# Altium schematic sheet LPC1769_2.SchDoc: LPC1769_2
size A4
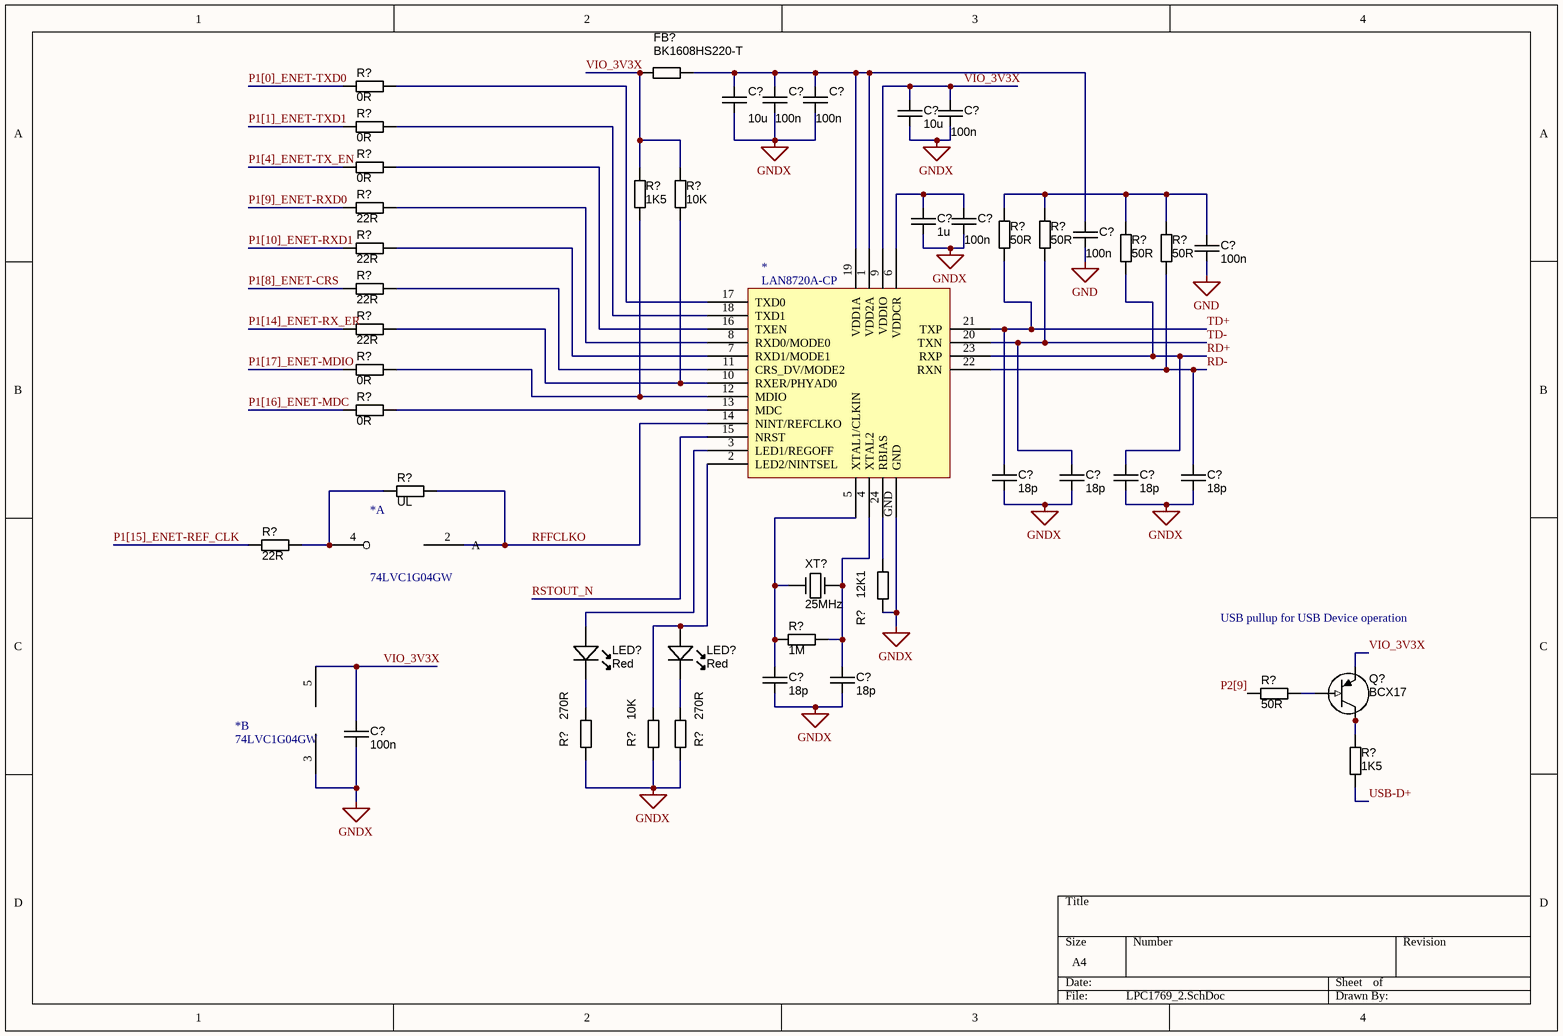
[diagram p0: LPC1769_2.SchDoc]

## Parts
(Parts that share a designator on the sheet are numbered #1, #2 ... from top to bottom, then left to right.)
*#1  LAN8720A-CP
*#2  74LVC1G04GW  (part A of 2)
*#3  74LVC1G04GW  (part B of 2)
C?#1  value 10u  [CAPC2012N]  (hidden comment: approved sub OK)
C?#2  value 100n  [CAPC2012N]  (hidden comment: approved sub OK)
C?#3  value 100n  [CAPC2012N]  (hidden comment: approved sub OK)
C?#4  value 10u  [CAPC2012N]  (hidden comment: approved sub OK)
C?#5  value 100n  [CAPC2012N]  (hidden comment: approved sub OK)
C?#6  value 1u  [CAPC2012N]  (hidden comment: approved sub OK)
C?#7  value 100n  [CAPC2012N]  (hidden comment: approved sub OK)
C?#8  value 100n  [CAPC2012N]  (hidden comment: approved sub OK)
C?#9  value 100n  [CAPC2012N]  (hidden comment: approved sub OK)
C?#10  value 18p  [CAPC2012N]  (hidden comment: approved sub OK)
C?#11  value 18p  [CAPC2012N]  (hidden comment: approved sub OK)
C?#12  value 18p  [CAPC2012N]  (hidden comment: approved sub OK)
C?#13  value 18p  [CAPC2012N]  (hidden comment: approved sub OK)
C?#14  value 18p  [CAPC2012N]  (hidden comment: approved sub OK)
C?#15  value 18p  [CAPC2012N]  (hidden comment: approved sub OK)
C?#16  value 100n  [CAPC2012N]  (hidden comment: approved sub OK)
FB?  value BK1608HS220-T  [RESC1005N]  (hidden comment: Thick Film)
LED?#1  Red  [LED-0805-A]
LED?#2  Red  [LED-0805-A]
Q?  Manufacturer Part Number 1: BCX17  [SOT223]  (hidden comment: PNP)
R?#1  value 0R  [RESC1005N]  (hidden comment: Thick Film)
R?#2  value 0R  [RESC1005N]  (hidden comment: Thick Film)
R?#3  value 0R  [RESC1005N]  (hidden comment: Thick Film)
R?#4  value 1K5  [RESC1005N]  (hidden comment: Thick Film)
R?#5  value 10K  [RESC1005N]  (hidden comment: Thick Film)
R?#6  value 22R  [RESC1005N]  (hidden comment: Thick Film)
R?#7  value 50R  [RESC1005N]  (hidden comment: Thick Film)
R?#8  value 50R  [RESC1005N]  (hidden comment: Thick Film)
R?#9  value 22R  [RESC1005N]  (hidden comment: Thick Film)
R?#10  value 50R  [RESC1005N]  (hidden comment: Thick Film)
R?#11  value 50R  [RESC1005N]  (hidden comment: Thick Film)
R?#12  value 22R  [RESC1005N]  (hidden comment: Thick Film)
R?#13  value 22R  [RESC1005N]  (hidden comment: Thick Film)
R?#14  value 0R  [RESC1005N]  (hidden comment: Thick Film)
R?#15  value 0R  [RESC1005N]  (hidden comment: Thick Film)
R?#16  value UL  [RESC1005N]  (hidden comment: Thick Film)
R?#17  value 22R  [RESC1005N]  (hidden comment: Thick Film)
R?#18  value 12K1  [RESC1005N]  (hidden comment: Thick Film)
R?#19  value 1M  [RESC1005N]  (hidden comment: Thick Film)
R?#20  value 50R  [RESC1005N]  (hidden comment: Thick Film)
R?#21  value 270R  [RESC1005N]  (hidden comment: Thick Film)
R?#22  value 10K  [RESC1005N]  (hidden comment: Thick Film)
R?#23  value 270R  [RESC1005N]  (hidden comment: Thick Film)
R?#24  value 1K5  [RESC1005N]  (hidden comment: Thick Film)
XT?  25MHz  [CRYSTAL_HC49-US-SM]

## Nets
GND: C?#8.1 C?#9.1
GNDX: *#1.GND C?#1.1 C?#2.1 C?#3.1 C?#4.1 C?#5.1 C?#6.1 C?#7.1 C?#10.1 C?#11.1 C?#12.1 C?#13.1 C?#14.1 C?#15.1 C?#16.1 R?#18.2 R?#21.1 R?#22.1 R?#23.1
P1[0]_ENET-TXD0: R?#1.1
P1[1]_ENET-TXD1: R?#2.1
P1[4]_ENET-TX_EN: R?#3.1
P1[8]_ENET-CRS: R?#12.1
P1[9]_ENET-RXD0: R?#6.1
P1[10]_ENET-RXD1: R?#9.1
P1[14]_ENET-RX_ER: R?#13.1
P1[15]_ENET-REF_CLK: R?#17.1
P1[16]_ENET-MDC: R?#15.1
P1[17]_ENET-MDIO: R?#14.1
RD+: *#1.23(RXP) C?#12.2 R?#10.2
RD-: *#1.22(RXN) C?#13.2 R?#11.2
RFFCLKO: *#1.14(NINT/REFCLKO) R?#16.1
RSTOUT_N: *#1.15(NRST)
TD+: *#1.21(TXP) C?#10.2 R?#7.2
TD-: *#1.20(TXN) C?#11.2 R?#8.2
USB-D+: R?#24.2
VIO_3V3X: *#1.9(VDDIO) C?#4.2 C?#5.2 C?#16.2 FB?.1 Q?.3(E) R?#4.1 R?#5.1
Net*#1_1: *#1.1(VDD2A) *#1.19(VDD1A) C?#1.2 C?#2.2 C?#3.2 C?#8.2 FB?.2
Net*#1_2: *#1.2(LED2/NINTSEL) LED?#2.A R?#22.2
Net*#1_3: *#1.3(LED1/REGOFF) LED?#1.A
Net*#1_4: *#1.4(XTAL2) C?#15.2 R?#19.2 XT?.2(OUT)
Net*#1_5: *#1.5(XTAL1/CLKIN) C?#14.2 R?#19.1 XT?.1(IN)
Net*#1_6: *#1.6(VDDCR) C?#6.2 C?#7.2
Net*#1_7: *#1.7(RXD1/MODE1) R?#9.2
Net*#1_8: *#1.8(RXD0/MODE0) R?#6.2
Net*#1_10: *#1.10(RXER/PHYAD0) R?#5.2 R?#13.2
Net*#1_11: *#1.11(CRS_DV/MODE2) R?#12.2
Net*#1_12: *#1.12(MDIO) R?#4.2 R?#14.2
Net*#1_13: *#1.13(MDC) R?#15.2
Net*#1_16: *#1.16(TXEN) R?#3.2
Net*#1_17: *#1.17(TXD0) R?#1.2
Net*#1_18: *#1.18(TXD1) R?#2.2
Net*#1_24: *#1.24(RBIAS) R?#18.1
Net*#2_4: *#2.4 R?#16.2 R?#17.2
NetC?#9_2: C?#9.2 R?#7.1 R?#8.1 R?#10.1 R?#11.1
NetLED?#1_K: LED?#1.K R?#21.2
NetLED?#2_K: LED?#2.K R?#23.2
NetQ?_1: Q?.1(B) R?#20.1
NetQ?_2: Q?.2(C) Q?.4(C) R?#24.1

Not connected (* = marked no-connect by the designer): *#2 2(A); *#3 3(GND) 5(VCC); R?#20 2

## Notes on the sheet
- USB pullup for USB Device operation
- Labels drawn without touching a wire or pin: P2[9]

## Library data of the parts
C?#1-C?#16 = CAPC_100n_0805: Capacitor SMD Cer 100nF 10% 50V X7R 0805; Manufacturer 1: Kemet; Manufacturer Part Number 1: C0805C104K5RACTU; Tolerance: ?0%; Ratings: 50V; X7R; Material: ceramic; Package / Case: 0805 (2012 metric); Supplier 1: Digi-Key; Supplier Part Number 1: 399-1170-1-ND
FB? R?#1-R?#24 = RES_330R_0402_5%: Resistor SMD chip 330 Ohm 0.063W 5% 0402; Manufacturer 1: Yageo; Manufacturer Part Number 1: RC0402JR-07330RL; Ratings: 1/16 W; Tolerance: ?%; Package / Case: 0402 (1005 Metric); Supplier 1: Digi-Key; Supplier Part Number 1: 311-330JRCT-ND; ComponentLink1URL: http://www.yageo.com/documents/recent/PYu-RC0402_51_RoHS_L_6.pdf; ComponentLink1Description: http://www.yageo.com/documents/recent/PYu-RC0402_51_RoHS_L_6.pdf
LED?#1 LED?#2 = LED_SMD_Red_0805: LED, 0805 SMD, Red; Manufacturer 1: Ligitek; Manufacturer Part Number 1: LG170SR-CT; Material: GaAIAs; Ratings: 20 mcd; 643 nm; Package / Case: 0805
Q? = PNP_NSS60600MZ4T1G: Transistor SMD PNP 60V 6A 800mW SOT-223; Manufacturer 1: ON Semiconductor; Ratings: 60V; 6A; 800mW; Material: Si; Package / Case: SOT-223; Transistor Type: PNP; Mounting Type: Surface Mount; Supplier 1: Digi-Key; Supplier Part Number 1: NSS60600MZ4T1GOSCT-ND
XT? = Crystal_6MHz_HC49/US: Resonator Ceramic 6.00 MHz 30ppm; Manufacturer 1: CTS-Frequency Controls; Manufacturer Part Number 1: ATS060BSM-1; Frequency: 6MHz; Frequency Stability: ?0ppm; Load Capacitance: 18pF; Operating Mode: Fundamental; Parameter Name: 0.169" (4.30mm); Package / Case: HC49/US-SM; Ratings: 6.00 MHz; Supplier 1: Digi-Key; Supplier Part Number 1: CTX882CT-ND; Type: MHz Crystal; Frequency Tolerance: ?0ppm; Operating Temperature: -20°C ~ 70°C; Mounting Type: Surface Mount; Size / Dimension: 0.437" L x 0.190" W (11.10mm x 4.83mm); ComponentLink1URL: http://www.ctscorp.com/components/Datasheets/008-0309-0.pdf; ComponentLink1Description: http://www.ctscorp.com/components/Datasheets/008-0309-0.pdf